# EasyEDA schematic SCH_CyBorgSPP.json

## Sheets
1 CyBorgSPP: TITLE: CyBorgSPP - Standard Parallel Port; REV: 1.0; Date: 2024-10-16; Sheet: 1/2; Drawn By: Chris Brunner; Company: CyrusBuilt
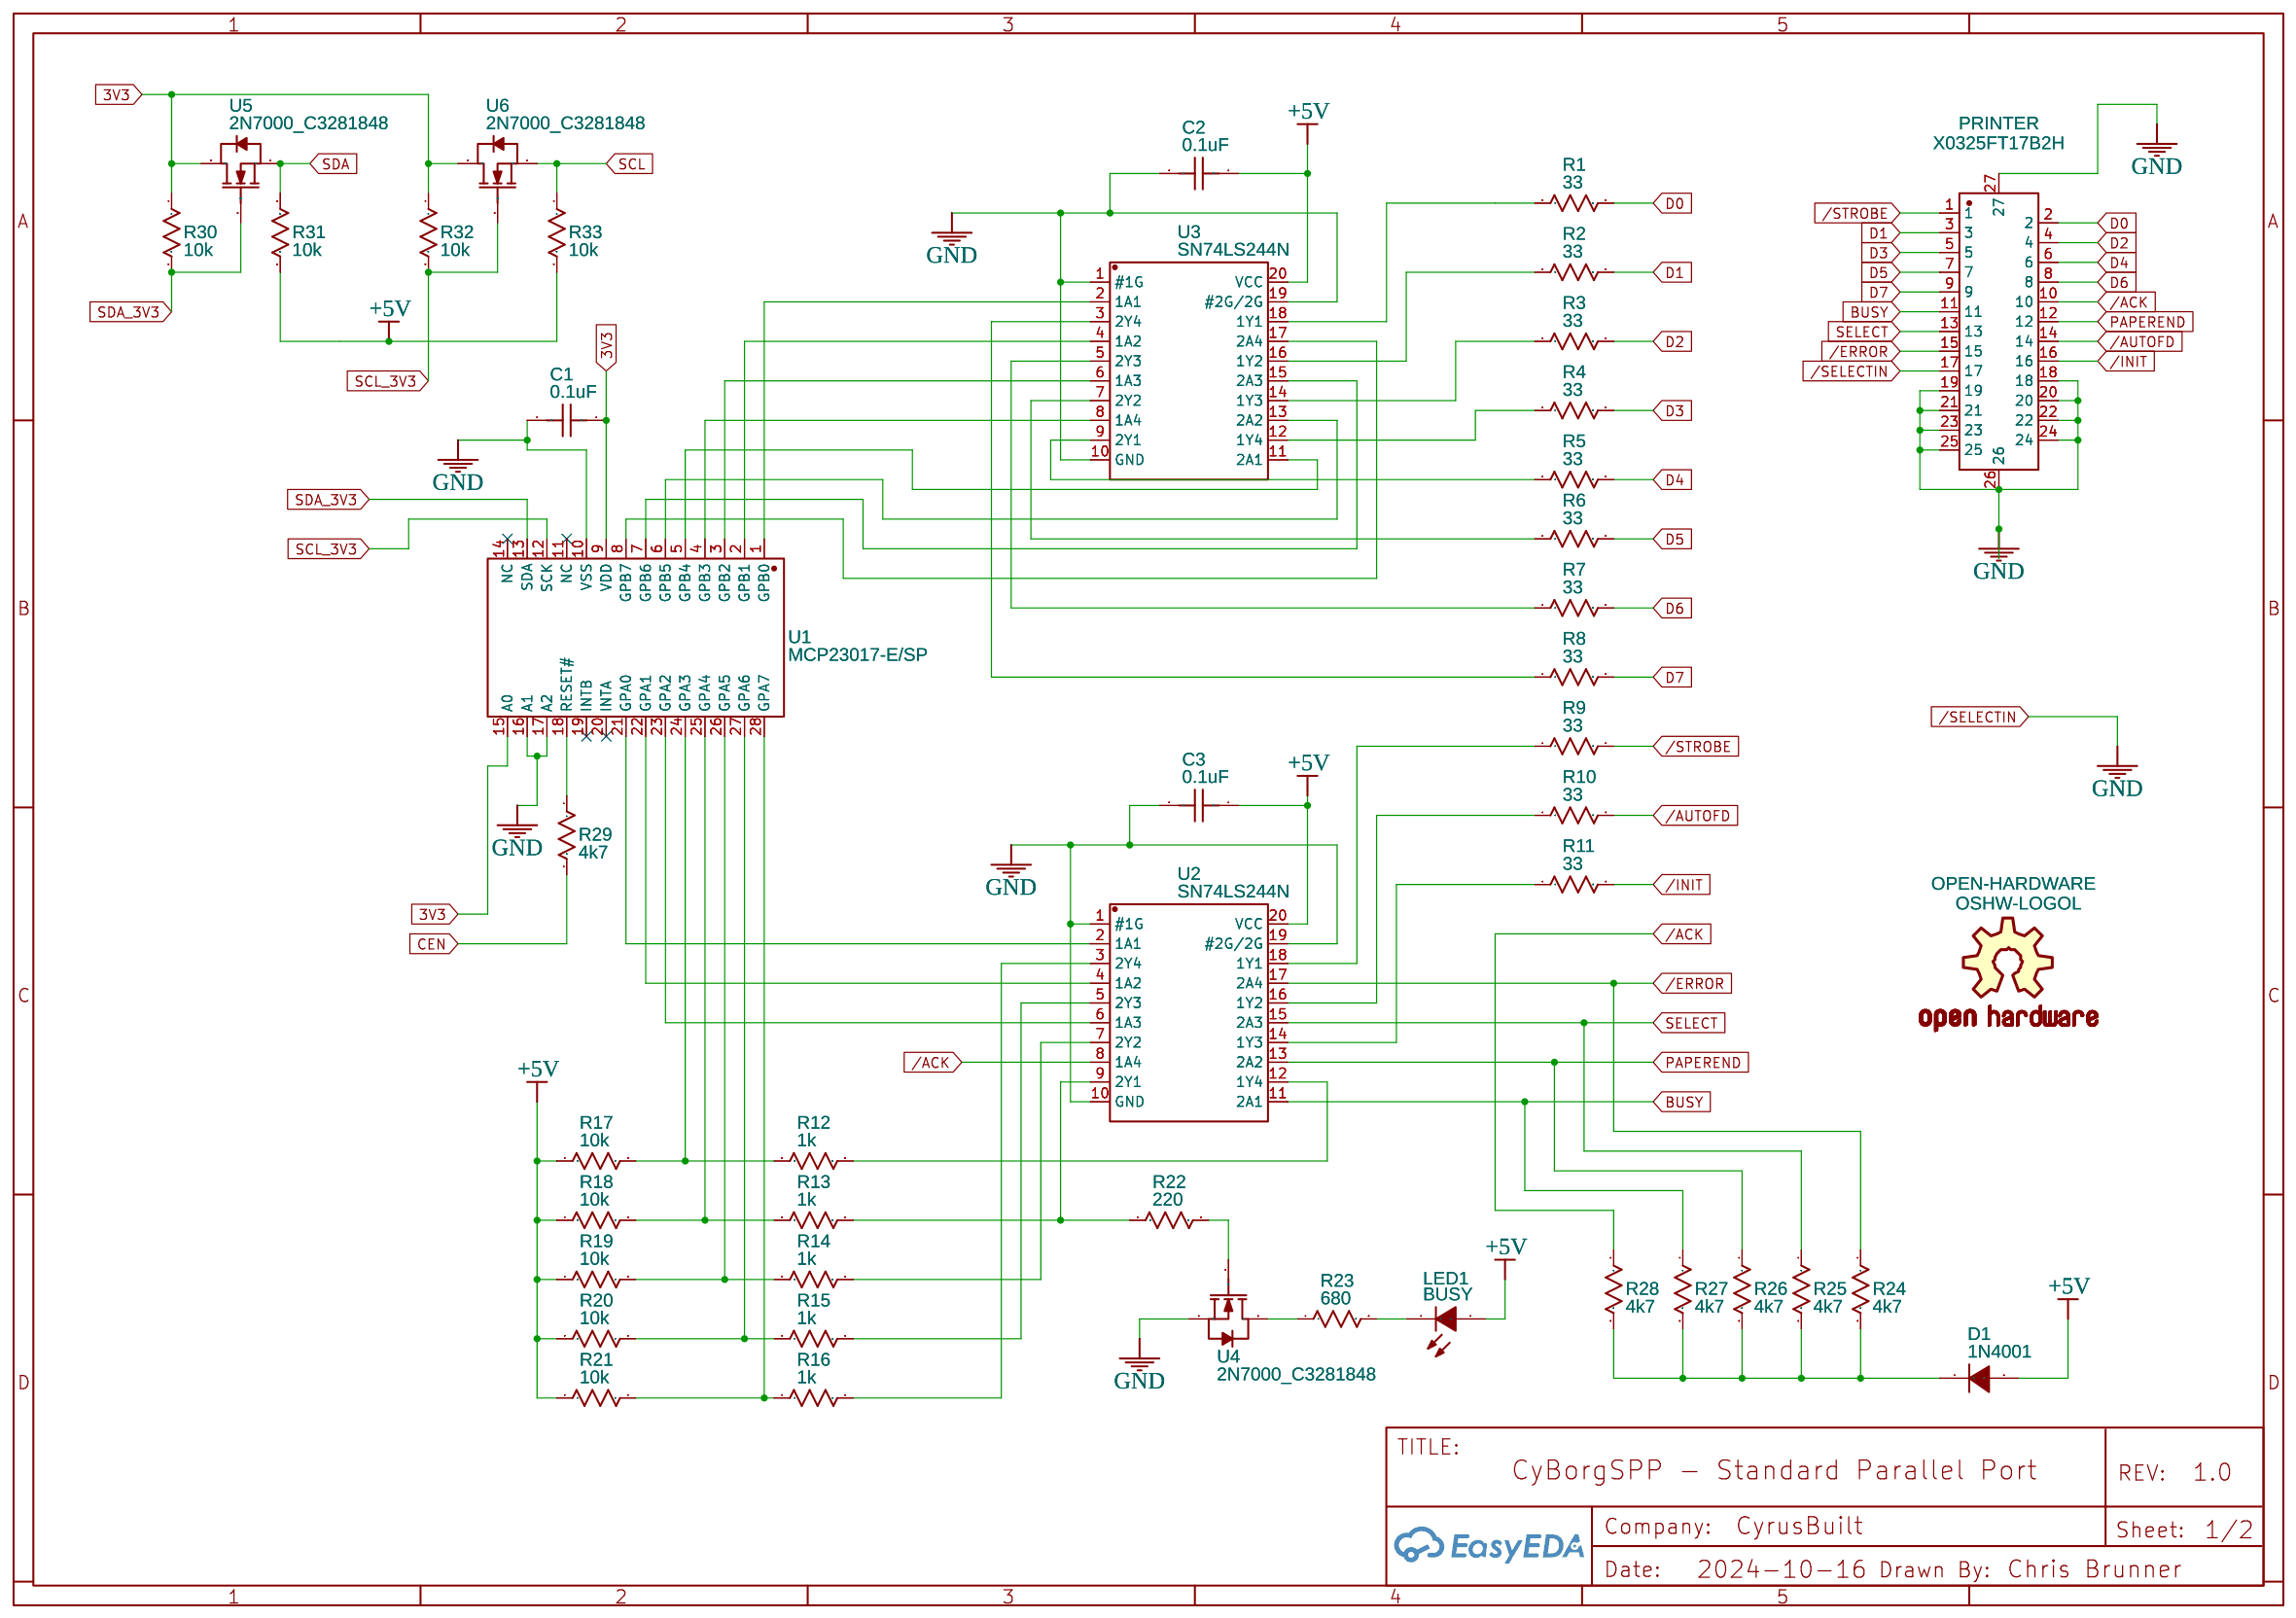
[diagram p0: CyBorgSPP]
2 CyBorgSPP_Bus: TITLE: CyBorgSPP - Bus Connector; Date: 2024-11-04; Sheet: 2/2
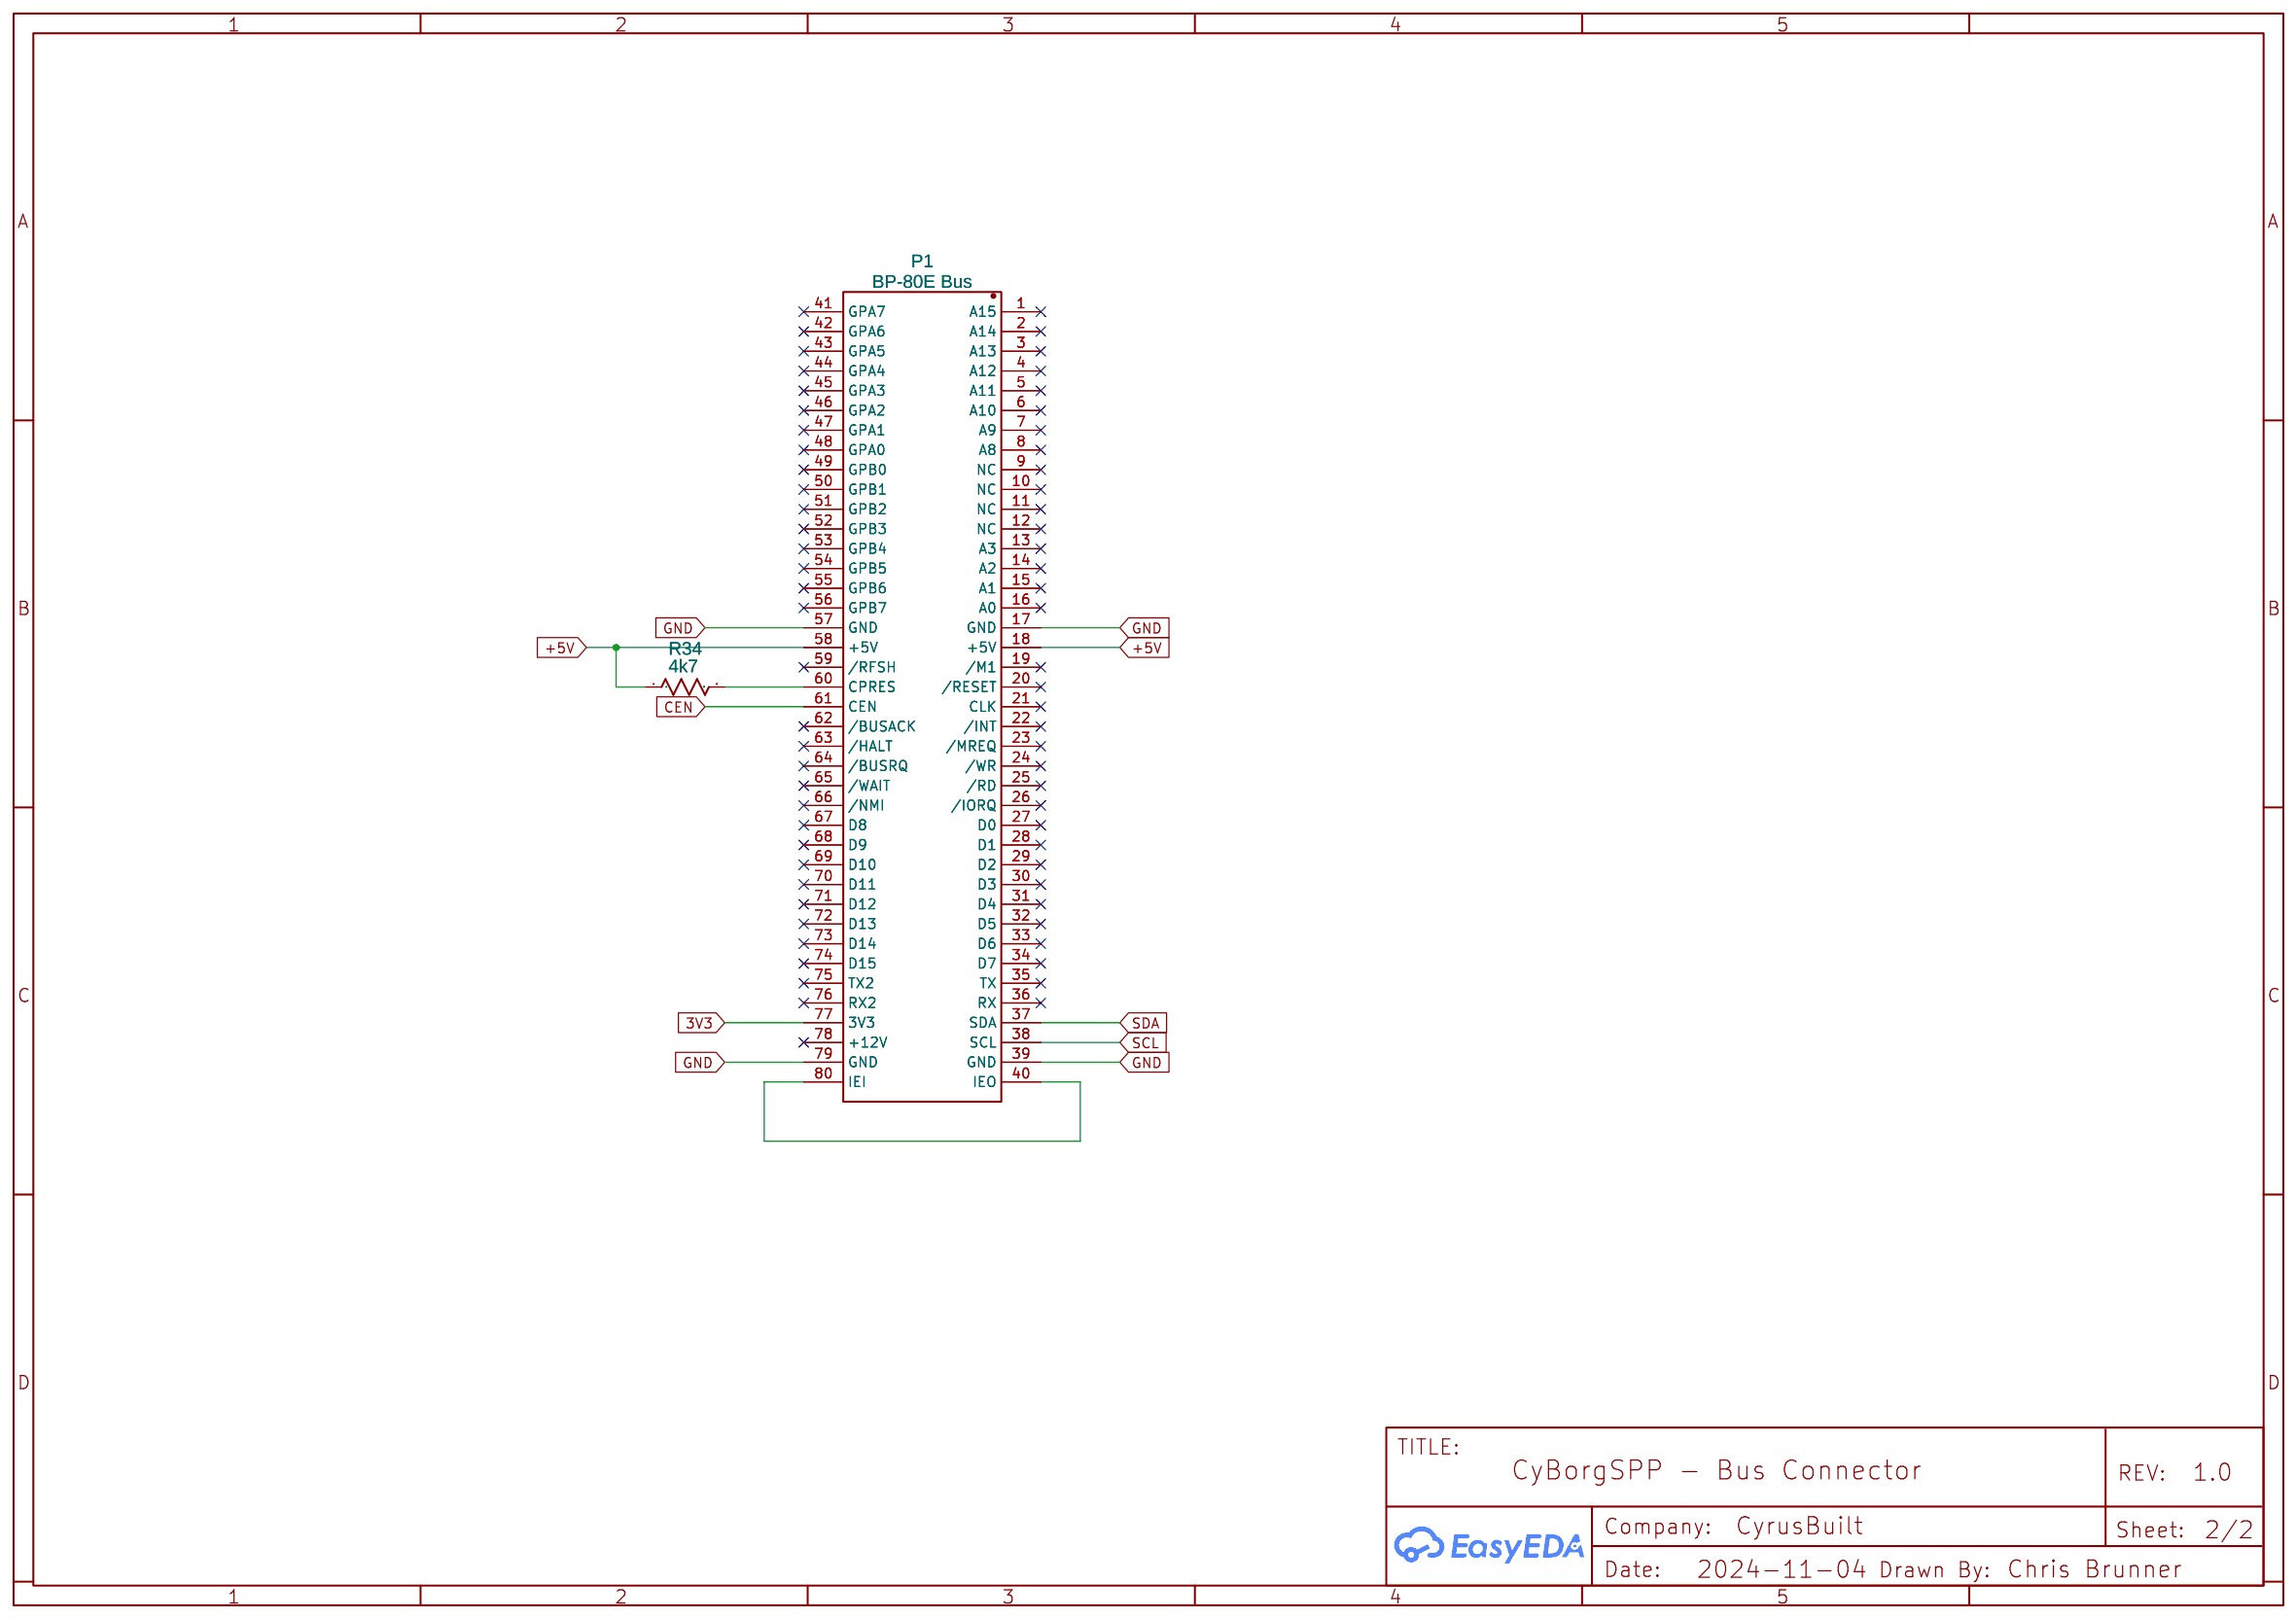
[diagram p1: CyBorgSPP_Bus]

## Parts
sheet CyBorgSPP
C1  0.1uF  [CAP-RAD-2.54MM]
C2  0.1uF  [CAP-RAD-2.54MM]
C3  0.1uF  [CAP-RAD-2.54MM]
D1  1N4001  [DO-41_BD2.4-L4.7-P8.70-D0.9-RD]
LED1  BUSY  [LED-TH_BD3.0-P2.54-FD]
OPEN-HARDWARE  OSHW-LOGOL  [OSHW-LOGO-L]
PRINTER  X0325FT17B2H  [DSUB-TH_25P-P2.77_C3123041]
R1  33  [PKG-0.25W RESISTOR]
R2  33  [PKG-0.25W RESISTOR]
R3  33  [PKG-0.25W RESISTOR]
R4  33  [PKG-0.25W RESISTOR]
R5  33  [PKG-0.25W RESISTOR]
R6  33  [PKG-0.25W RESISTOR]
R7  33  [PKG-0.25W RESISTOR]
R8  33  [PKG-0.25W RESISTOR]
R9  33  [PKG-0.25W RESISTOR]
R10  33  [PKG-0.25W RESISTOR]
R11  33  [PKG-0.25W RESISTOR]
R12  1k  [PKG-0.25W RESISTOR]
R13  1k  [PKG-0.25W RESISTOR]
R14  1k  [PKG-0.25W RESISTOR]
R15  1k  [PKG-0.25W RESISTOR]
R16  1k  [PKG-0.25W RESISTOR]
R17  10k  [PKG-0.25W RESISTOR]
R18  10k  [PKG-0.25W RESISTOR]
R19  10k  [PKG-0.25W RESISTOR]
R20  10k  [PKG-0.25W RESISTOR]
R21  10k  [PKG-0.25W RESISTOR]
R22  220  [PKG-0.25W RESISTOR]
R23  680  [PKG-0.25W RESISTOR]
R24  4k7  [PKG-0.25W RESISTOR]
R25  4k7  [PKG-0.25W RESISTOR]
R26  4k7  [PKG-0.25W RESISTOR]
R27  4k7  [PKG-0.25W RESISTOR]
R28  4k7  [PKG-0.25W RESISTOR]
R29  4k7  [PKG-0.25W RESISTOR]
R30  10k  [PKG-0.25W RESISTOR]
R31  10k  [PKG-0.25W RESISTOR]
R32  10k  [PKG-0.25W RESISTOR]
R33  10k  [PKG-0.25W RESISTOR]
U1  MCP23017-E/SP  [DIP-28_L35.0-W6.5-P2.54-LS7.6-BL]
U2  SN74LS244N  [DIP-20_L25.5-W10.0-P2.54-LS7.6-BL]
U3  SN74LS244N  [DIP-20_L25.5-W10.0-P2.54-LS7.6-BL]
U4  2N7000_C3281848  [TO-92-3_L4.9-W3.7-P1.27-L]
U5  2N7000_C3281848  [TO-92-3_L4.9-W3.7-P1.27-L]
U6  2N7000_C3281848  [TO-92-3_L4.9-W3.7-P1.27-L]
sheet CyBorgSPP_Bus
P1  BP-80E Bus  [PIN_HEADER_ANGLED_2X40_PITCH2.54MM]
R34  4k7  [PKG-0.25W RESISTOR]

## Library data of the parts
C1-C3 = C_0603_US: Contributor: LCEDA_Lib
D1 = 1N4001: Supplier: LCSC; Manufacturer: LRC; Supplier Part: C82804
LED1 = 204-10SURD/S530-A3: Supplier: LCSC; Manufacturer: EVERLIGHT(亿光); Supplier Part: C99772; JLCPCB Part Class: Extended Part
OPEN-HARDWARE = OSHW-LOGOL: Contributor: SebSebSeb
PRINTER = X0325FT17B2H: Supplier: LCSC; Supplier Part: C18723072; Manufacturer: XKB Connectivity(中国星坤); Contributor: lcsc; JLCPCB Part Class: Extended Part
R1-R34 = MCF 0.25W 150R: Power: 1/4W; Tolerance: ±5%; Supplier Part: 9339175; Supplier: Element14; Manufacturer: MULTICOMP; link: http://www.farnell.com/datasheets/2861447.pdf; Contributor: Prof. Ing. F. Scordino
U1 = MCP23017-E/SP: Supplier: LCSC; Supplier Part: C647352; Manufacturer: Microchip Tech; Contributor: LCSC; JLCPCB Part Class: Extended Part
U2 U3 = SN74LS244N: Contributor: LCSC; Supplier: LCSC; Supplier Part: C352965; Manufacturer: TI(德州仪器); JLCPCB Part Class: Extended Part
U4-U6 = 2N7000_C3281848: Contributor: lcsc; Supplier: LCSC; Supplier Part: C3281848; Manufacturer: DIOTEC(德欧泰克); Manufacturer Part: 2N7000; JLCPCB Part Class: Extended Part
P1 = Extended Backplane 2x40 Male Angled: Supplier Part: C3410; Supplier: LCSC; Manufacturer: 2.54mm 1x40T Female header; Manufacturer Part: ReliaPro; Contributor: peabody1929

## Nets
3V3: C1.1 P1.77(3V3) R30.1 R32.1 U1.9(VDD) U1.15(A0) U5.3(D) U6.3(D)
+5V: C2.1 C3.1 D1.2(A) LED1.1(A) P1.18(+5V) P1.58(+5V) R17.1 R18.1 R19.1 R20.1 R21.1 R31.2 R33.2 R34.1 U2.20(VCC) U3.20(VCC)
/ACK: PRINTER.10 R28.1 U2.8(1A4)
/AUTOFD: PRINTER.14 R10.2
/ERROR: PRINTER.15 R24.1 U2.17(2A4)
/INIT: PRINTER.16 R11.2
/SELECTIN: C1.2 C2.2 C3.2 P1.17(GND) P1.39(GND) P1.57(GND) P1.79(GND) PRINTER.17 PRINTER.18 PRINTER.19 PRINTER.20 PRINTER.21 PRINTER.22 PRINTER.23 PRINTER.24 PRINTER.25 PRINTER.26 PRINTER.27 U1.10(VSS) U1.16(A1) U1.17(A2) U2.1(#1G) U2.10(GND) U2.19(#2G/2G) U3.1(#1G) U3.10(GND) U3.19(#2G/2G) U4.1(S)
/STROBE: PRINTER.1 R9.2
BUSY: PRINTER.11 R27.1 U2.11(2A1)
CEN: P1.61(CEN) R29.2
D0: PRINTER.2 R1.2
D1: PRINTER.3 R2.2
D2: PRINTER.4 R3.2
D3: PRINTER.5 R4.2
D4: PRINTER.6 R5.2
D5: PRINTER.7 R6.2
D6: PRINTER.8 R7.2
D7: PRINTER.9 R8.2
PAPEREND: PRINTER.12 R26.1 U2.13(2A2)
SCL: P1.38(SCL) R33.1 U6.1(S)
SCL_3V3: R32.2 U1.12(SCK) U6.2(G)
SDA: P1.37(SDA) R31.1 U5.1(S)
SDA_3V3: R30.2 U1.13(SDA) U5.2(G)
SELECT: PRINTER.13 R25.1 U2.15(2A3)
Net-(D1-1): D1.1(K) R24.2 R25.2 R26.2 R27.2 R28.2
Net-(LED1-2): LED1.2(K) R23.2
Net-(P1-40): P1.40(IEO) P1.80(IEI)
Net-(P1-60): P1.60(CPRES) R34.2
Net-(R1-1): R1.1 U3.18(1Y1)
Net-(R2-1): R2.1 U3.16(1Y2)
Net-(R3-1): R3.1 U3.14(1Y3)
Net-(R4-1): R4.1 U3.12(1Y4)
Net-(R5-1): R5.1 U3.9(2Y1)
Net-(R6-1): R6.1 U3.7(2Y2)
Net-(R7-1): R7.1 U3.5(2Y3)
Net-(R8-1): R8.1 U3.3(2Y4)
Net-(R9-1): R9.1 U2.18(1Y1)
Net-(R10-1): R10.1 U2.16(1Y2)
Net-(R11-1): R11.1 U2.14(1Y3)
Net-(R12-1): R12.1 R17.2 U1.24(GPA3)
Net-(R12-2): R12.2 U2.12(1Y4)
Net-(R13-1): R13.1 R18.2 U1.25(GPA4)
Net-(R13-2): R13.2 R22.1 U2.9(2Y1)
Net-(R14-1): R14.1 R19.2 U1.26(GPA5)
Net-(R14-2): R14.2 U2.7(2Y2)
Net-(R15-1): R15.1 R20.2 U1.27(GPA6)
Net-(R15-2): R15.2 U2.5(2Y3)
Net-(R16-1): R16.1 R21.2 U1.28(GPA7)
Net-(R16-2): R16.2 U2.3(2Y4)
Net-(R22-2): R22.2 U4.2(G)
Net-(R23-1): R23.1 U4.3(D)
Net-(R29-1): R29.1 U1.18(RESET#)
Net-(U1-1): U1.1(GPB0) U3.2(1A1)
Net-(U1-2): U1.2(GPB1) U3.4(1A2)
Net-(U1-3): U1.3(GPB2) U3.6(1A3)
Net-(U1-4): U1.4(GPB3) U3.8(1A4)
Net-(U1-5): U1.5(GPB4) U3.11(2A1)
Net-(U1-6): U1.6(GPB5) U3.13(2A2)
Net-(U1-7): U1.7(GPB6) U3.15(2A3)
Net-(U1-8): U1.8(GPB7) U3.17(2A4)
Net-(U1-21): U1.21(GPA0) U2.2(1A1)
Net-(U1-22): U1.22(GPA1) U2.4(1A2)
Net-(U1-23): U1.23(GPA2) U2.6(1A3)

Not connected (* = marked no-connect by the designer): P1 1(A15)* 2(A14)* 3(A13)* 4(A12)* 5(A11)* 6(A10)* 7(A9)* 8(A8)* 9(NC)* 10(NC)* 11(NC)* 12(NC)* 13(A3)* 14(A2)* 15(A1)* 16(A0)* 19(/M1)* 20(/RESET)* 21(CLK)* 22(/INT)* 23(/MREQ)* 24(/WR)* 25(/RD)* 26(/IORQ)* 27(D0)* 28(D1)* 29(D2)* 30(D3)* 31(D4)* 32(D5)* 33(D6)* 34(D7)* 35(TX)* 36(RX)* 41(GPA7)* 42(GPA6)* 43(GPA5)* 44(GPA4)* 45(GPA3)* 46(GPA2)* 47(GPA1)* 48(GPA0)* 49(GPB0)* 50(GPB1)* 51(GPB2)* 52(GPB3)* 53(GPB4)* 54(GPB5)* 55(GPB6)* 56(GPB7)* 59(/RFSH)* 62(/BUSACK)* 63(/HALT)* 64(/BUSRQ)* 65(/WAIT)* 66(/NMI)* 67(D8)* 68(D9)* 69(D10)* 70(D11)* 71(D12)* 72(D13)* 73(D14)* 74(D15)* 75(TX2)* 76(RX2)* 78(+12V)*; U1 11(NC)* 14(NC)* 19(INTB)* 20(INTA)*
